# EasyEDA schematic Syntheseproject.json
TITLE: Sheet_1; REV: 1.0; Date: 2023-12-05; Sheet: 1/1; Drawn By: fl1ppermouse; Company: Your Company
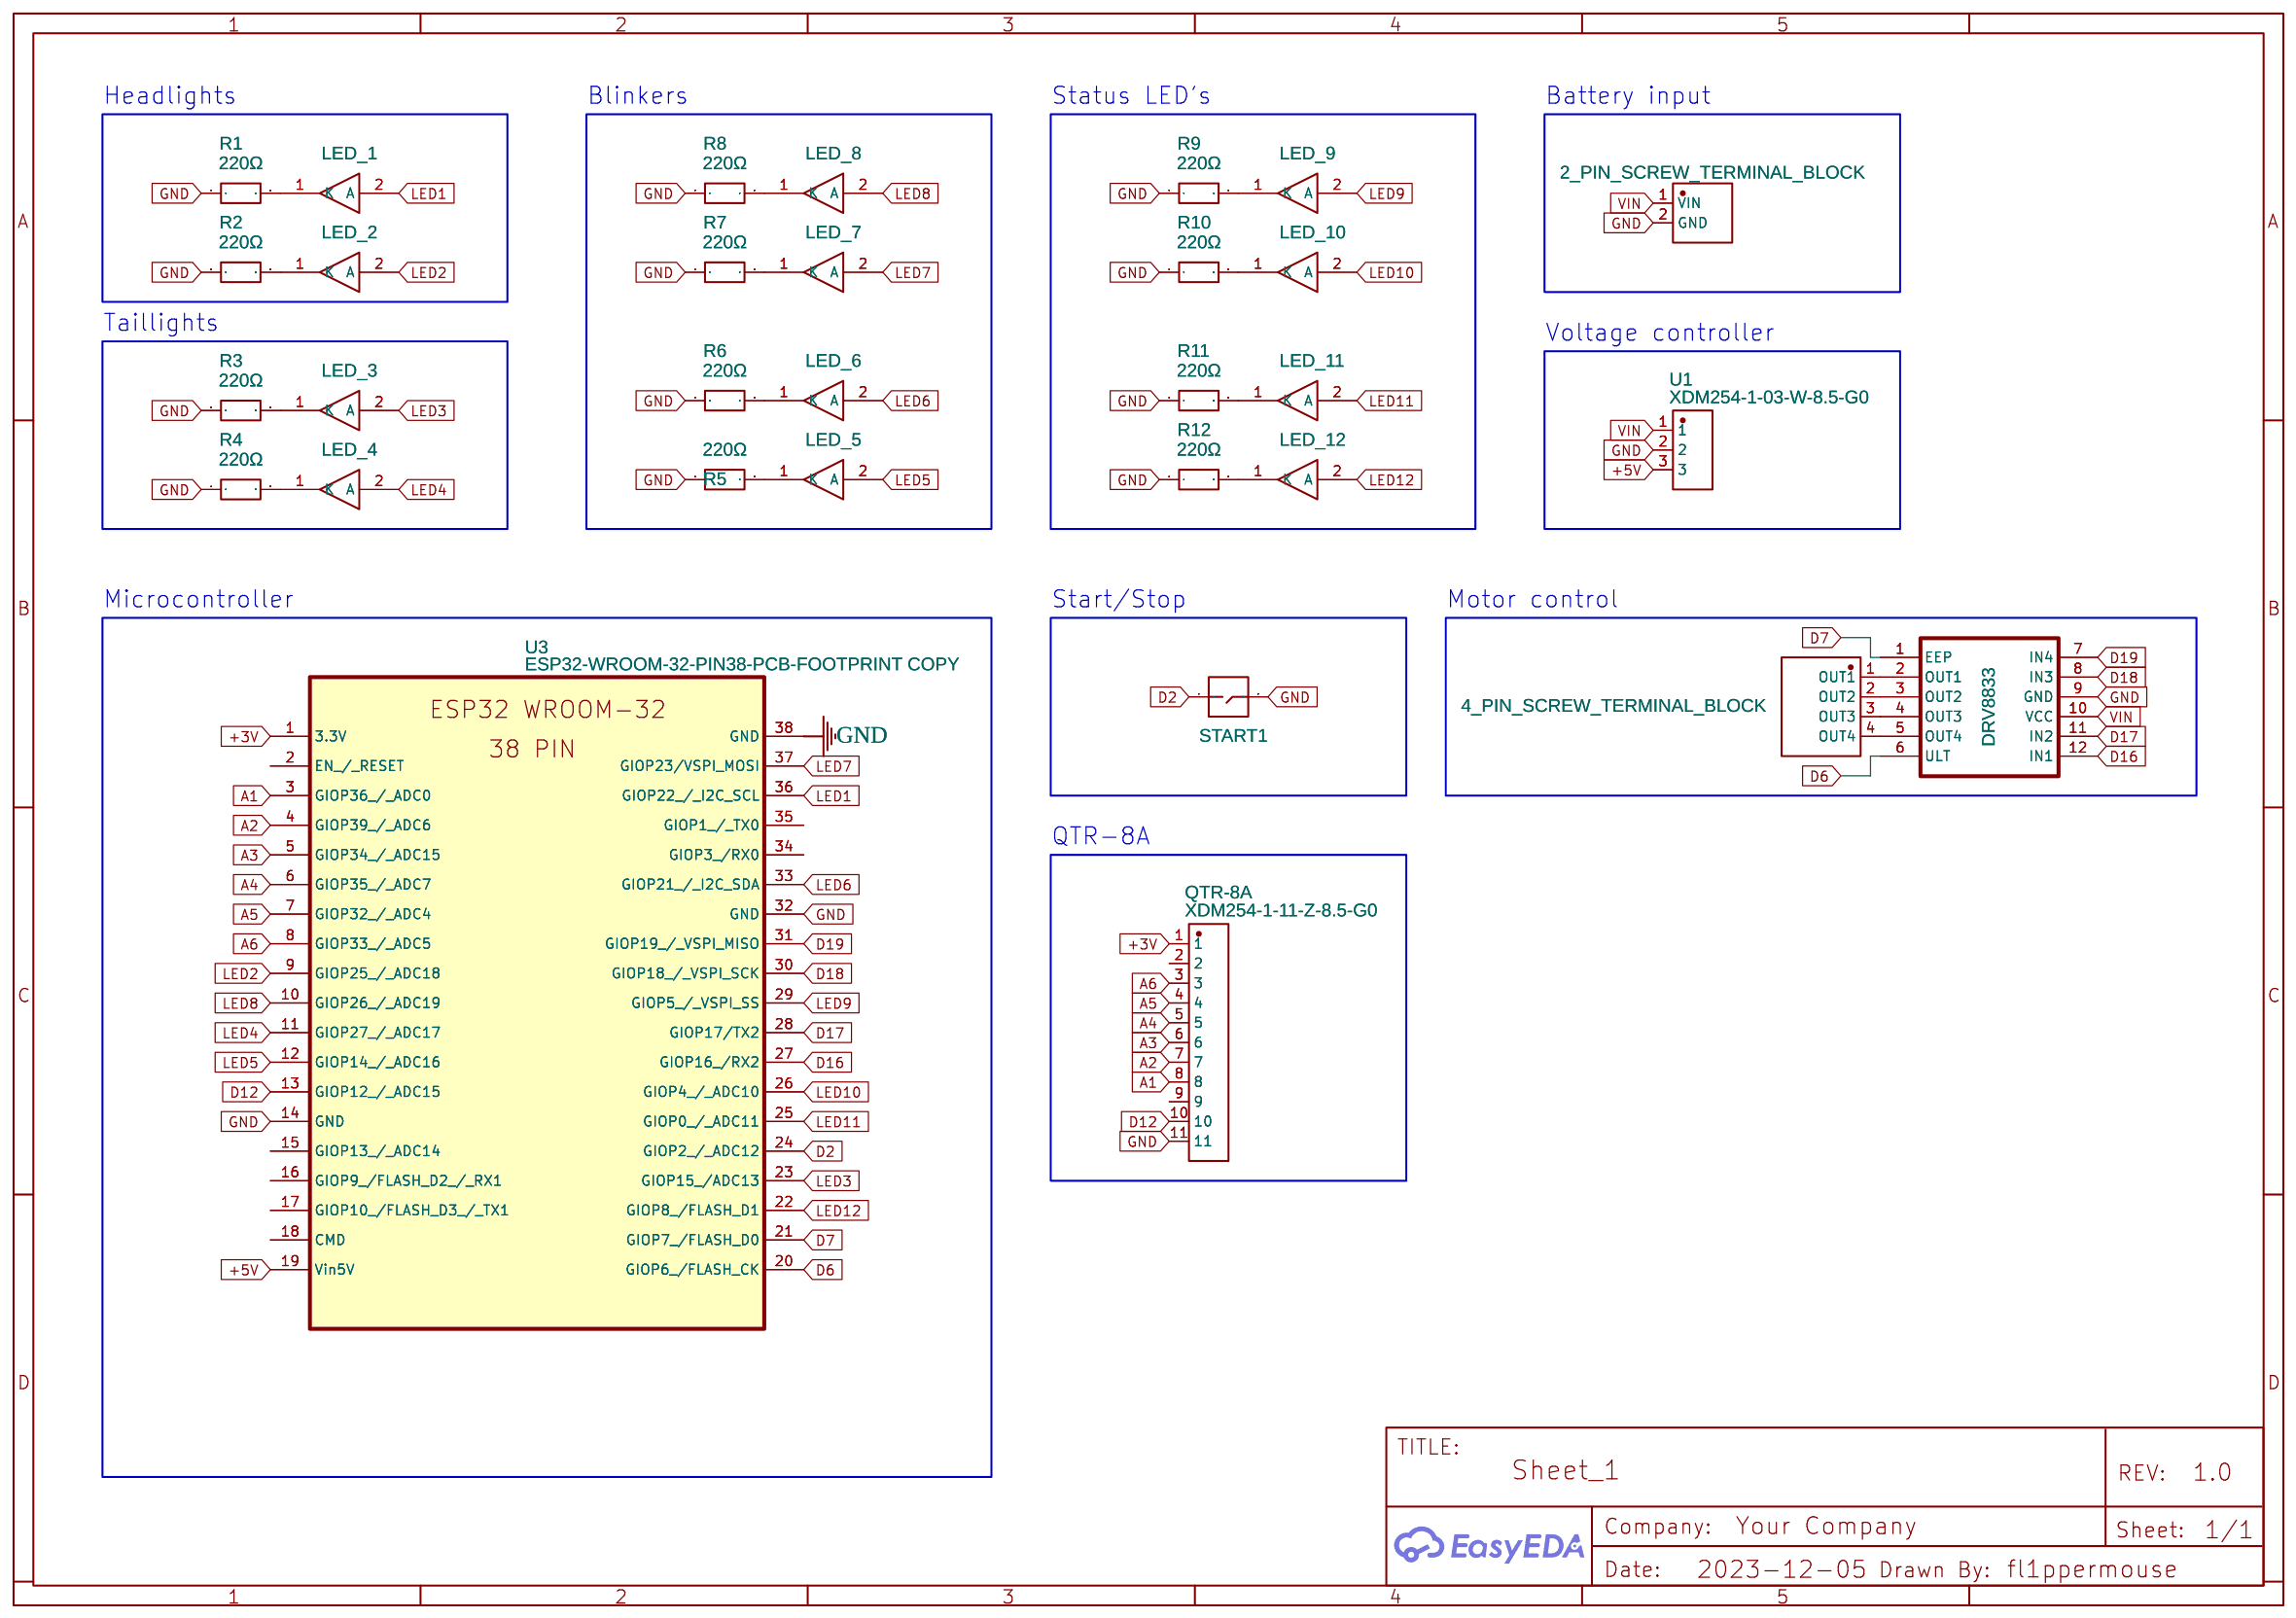
[diagram p0: schematic sheet]

## Parts
2_PIN_SCREW_TERMINAL_BLOCK  2 Pin Screw Terminal Block Connector 2.54 mm  [2 PIN SCREW TERMINAL BLOCK CONNECTOR 2.54 MM]
4_PIN_SCREW_TERMINAL_BLOCK  4 PIN SCREW TERMINAL BLOCK CONNECTOR 2.54 MM  [4 PIN SCREW TERMINAL BLOCK CONNECTOR 2.54 MM]
DRV8833  DRV8833  [DRV8833 (NO ORIGINAL)]
LED_1  led 5 mm  [FOOTPRINT_LED_5MM]
LED_2  led 5 mm  [FOOTPRINT_LED_5MM]
LED_3  led 5 mm  [FOOTPRINT_LED_5MM]
LED_4  led 5 mm  [FOOTPRINT_LED_5MM]
LED_5  led 5 mm  [FOOTPRINT_LED_5MM]
LED_6  led 5 mm  [FOOTPRINT_LED_5MM]
LED_7  led 5 mm  [FOOTPRINT_LED_5MM]
LED_8  led 5 mm  [FOOTPRINT_LED_5MM]
LED_9  led 5 mm  [FOOTPRINT_LED_5MM]
LED_10  led 5 mm  [FOOTPRINT_LED_5MM]
LED_11  led 5 mm  [FOOTPRINT_LED_5MM]
LED_12  led 5 mm  [FOOTPRINT_LED_5MM]
QTR-8A  XDM254-1-11-Z-8.5-G0  [HDR-TH_11P-P2.54-V-F-1]
R1  220Ω  [AXIAL RESISTOR 220 OHM - TH_BD2.3-L6.0-P10.00-D0.4]
R2  220Ω  [AXIAL RESISTOR 220 OHM - TH_BD2.3-L6.0-P10.00-D0.4]
R3  220Ω  [AXIAL RESISTOR 220 OHM - TH_BD2.3-L6.0-P10.00-D0.4]
R4  220Ω  [AXIAL RESISTOR 220 OHM - TH_BD2.3-L6.0-P10.00-D0.4]
R5  220Ω  [AXIAL RESISTOR 220 OHM - TH_BD2.3-L6.0-P10.00-D0.4]
R6  220Ω  [AXIAL RESISTOR 220 OHM - TH_BD2.3-L6.0-P10.00-D0.4]
R7  220Ω  [AXIAL RESISTOR 220 OHM - TH_BD2.3-L6.0-P10.00-D0.4]
R8  220Ω  [AXIAL RESISTOR 220 OHM - TH_BD2.3-L6.0-P10.00-D0.4]
R9  220Ω  [AXIAL RESISTOR 220 OHM - TH_BD2.3-L6.0-P10.00-D0.4]
R10  220Ω  [AXIAL RESISTOR 220 OHM - TH_BD2.3-L6.0-P10.00-D0.4]
R11  220Ω  [AXIAL RESISTOR 220 OHM - TH_BD2.3-L6.0-P10.00-D0.4]
R12  220Ω  [AXIAL RESISTOR 220 OHM - TH_BD2.3-L6.0-P10.00-D0.4]
START1  start  [PUSHBUTTON]
U1  XDM254-1-03-W-8.5-G0  [HDR-TH_3P-P2.54-H-F-W10.3-N]
U3  ESP32-WROOM-32-PIN38-PCB-FOOTPRINT COPY  [ESP32-WROOM-32-38PIN-PCB-FOOTPRINT]

## Library data of the parts
2_PIN_SCREW_TERMINAL_BLOCK = 2 PIN SCREW TERMINAL BLOCK CONNECTOR 2.54 MM: Contributor: simonraman
4_PIN_SCREW_TERMINAL_BLOCK = 4 PIN SCREW TERMINAL BLOCK CONNECTOR 2.54 MM: Contributor: simonraman
DRV8833 = DRV8833 12PIN: Contributor: PiterSantaCruz
LED_1-LED_12 = led 5 mm: Contributor: umar_Eldikon
QTR-8A = XDM254-1-11-Z-8.5-G0: Supplier: LCSC; Supplier Part: C19268704; Manufacturer: XUNDA(讯答); Contributor: lcsc; link: https://lcsc.com/eda_search?q=C19268704&%26type=1&ref=editor
R1-R12 = AXIAL RESISTOR 220 OHM - TH_BD2.3-L6.0-P10.00-D0.4: Contributor: Waleed Kies; JLCPCB Part Class: Extended Part
START1 = Push Button: Contributor: Ahmed Elgendy
U1 = XDM254-1-03-W-8.5-G0: Supplier: LCSC; Supplier Part: C19268734; Manufacturer: XUNDA(讯答); Contributor: lcsc; link: https://lcsc.com/eda_search?q=C19268734&%26type=1&ref=editor
U3 = ESP32-WROOM-32-PIN38-PCB-FOOTPRINT COPY: Manufacturer: Espressif Systems; Manufacturer Part: ESP32-WROOM-32; Supplier Part: 1965-ESP32-DEVKITC-32U-ND; link: https://docs.espressif.com/projects/esp-idf/en/latest/esp32/hw-reference/esp32/get-started-devkitc.html; Contributor: fernando.mondragon; subpart_no: 1

## Nets
+3V: QTR-8A.1 U3.1(3.3V)
+5V: U1.3 U3.19(Vin5V)
GND: 2_PIN_SCREW_TERMINAL_BLOCK.2(GND) DRV8833.9(GND) QTR-8A.11 R1.1 R2.1 R3.1 R4.1 R5.1 R6.1 R7.1 R8.1 R9.1 R10.1 R11.1 R12.1 START1.2 U1.2 U3.14(GND) U3.32(GND) U3.38(GND)
VIN: 2_PIN_SCREW_TERMINAL_BLOCK.1(VIN) DRV8833.10(VCC) U1.1
A1: QTR-8A.8 U3.3(GIOP36 / ADC0)
A2: QTR-8A.7 U3.4(GIOP39 / ADC6)
A3: QTR-8A.6 U3.5(GIOP34 / ADC15)
A4: QTR-8A.5 U3.6(GIOP35 / ADC7)
A5: QTR-8A.4 U3.7(GIOP32 / ADC4)
A6: QTR-8A.3 U3.8(GIOP33 / ADC5)
D2: START1.1 U3.24(GIOP2 / ADC12)
D6: DRV8833.6(ULT) U3.20(GIOP6 /FLASH CK)
D7: DRV8833.1(EEP) U3.21(GIOP7 /FLASH D0)
D12: QTR-8A.10 U3.13(GIOP12 / ADC15)
D16: DRV8833.12(IN1) U3.27(GIOP16 /RX2)
D17: DRV8833.11(IN2) U3.28(GIOP17/TX2)
D18: DRV8833.8(IN3) U3.30(GIOP18 / VSPI SCK)
D19: DRV8833.7(IN4) U3.31(GIOP19 / VSPI MISO)
LED1: LED_1.2(A) U3.36(GIOP22 / I2C SCL)
LED2: LED_2.2(A) U3.9(GIOP25 / ADC18)
LED3: LED_3.2(A) U3.23(GIOP15 /ADC13)
LED4: LED_4.2(A) U3.11(GIOP27 / ADC17)
LED5: LED_5.2(A) U3.12(GIOP14 / ADC16)
LED6: LED_6.2(A) U3.33(GIOP21 / I2C SDA)
LED7: LED_7.2(A) U3.37(GIOP23/VSPI MOSI)
LED8: LED_8.2(A) U3.10(GIOP26 / ADC19)
LED9: LED_9.2(A) U3.29(GIOP5 / VSPI SS)
LED10: LED_10.2(A) U3.26(GIOP4 / ADC10)
LED11: LED_11.2(A) U3.25(GIOP0 / ADC11)
LED12: LED_12.2(A) U3.22(GIOP8 /FLASH D1)
Net-(4_PIN_SCREW_TERMINAL_BLOCK-1): 4_PIN_SCREW_TERMINAL_BLOCK.1(OUT1) DRV8833.2(OUT1)
Net-(4_PIN_SCREW_TERMINAL_BLOCK-2): 4_PIN_SCREW_TERMINAL_BLOCK.2(OUT2) DRV8833.3(OUT2)
Net-(4_PIN_SCREW_TERMINAL_BLOCK-3): 4_PIN_SCREW_TERMINAL_BLOCK.3(OUT3) DRV8833.4(OUT3)
Net-(4_PIN_SCREW_TERMINAL_BLOCK-4): 4_PIN_SCREW_TERMINAL_BLOCK.4(OUT4) DRV8833.5(OUT4)
Net-(LED_1-1): LED_1.1(K) R1.2
Net-(LED_2-1): LED_2.1(K) R2.2
Net-(LED_3-1): LED_3.1(K) R3.2
Net-(LED_4-1): LED_4.1(K) R4.2
Net-(LED_5-1): LED_5.1(K) R5.2
Net-(LED_6-1): LED_6.1(K) R6.2
Net-(LED_7-1): LED_7.1(K) R7.2
Net-(LED_8-1): LED_8.1(K) R8.2
Net-(LED_9-1): LED_9.1(K) R9.2
Net-(LED_10-1): LED_10.1(K) R10.2
Net-(LED_11-1): LED_11.1(K) R11.2
Net-(LED_12-1): LED_12.1(K) R12.2

Not connected (* = marked no-connect by the designer): QTR-8A 2 9; U3 2(EN / RESET) 15(GIOP13 / ADC14) 16(GIOP9 /FLASH D2 / RX1) 17(GIOP10 /FLASH D3 / TX1) 18(CMD) 34(GIOP3 /RX0) 35(GIOP1 / TX0)

## Notes on the sheet
- Headlights
- Blinkers
- Status LED's
- Battery input
- Taillights
- Voltage controller
- Microcontroller
- Start/Stop
- Motor control
- QTR-8A
